# Altium schematic sheet UWB_Conectores.SchDoc
size A4
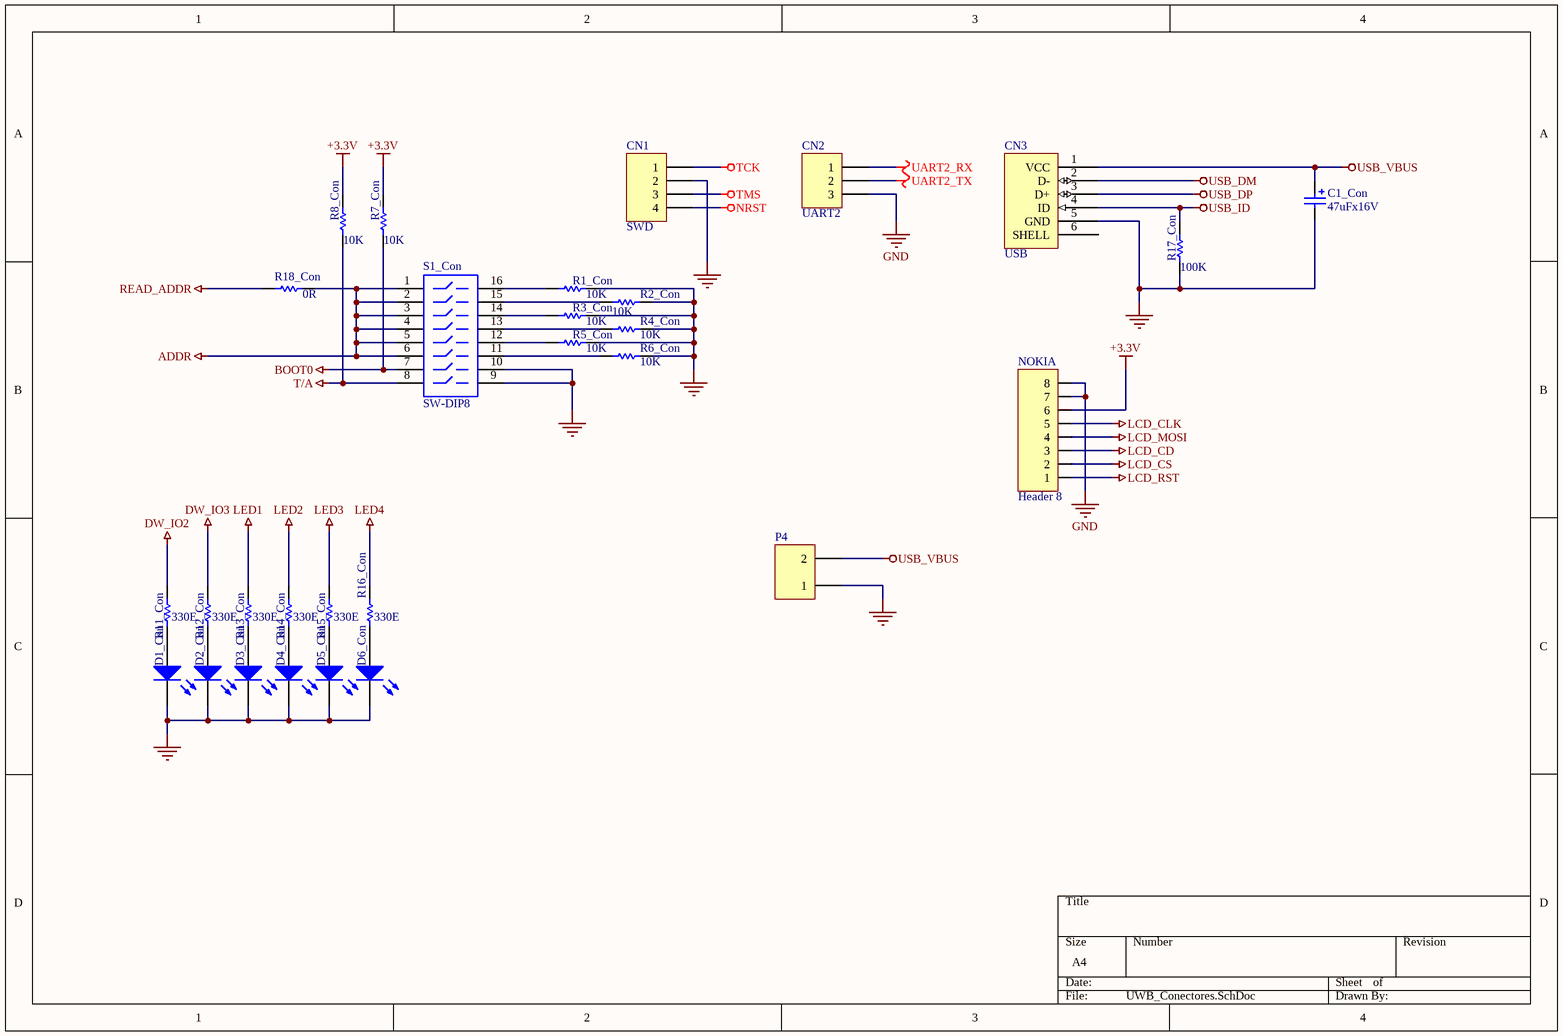
[diagram p0: UWB_Conectores.SchDoc]

## Parts
C1_Con  value 47uFx16V  [Panasonic Size D (Dia. 6.3)]  (hidden comment: Cap Pol1)
CN1  SWD  [HDR1X4 - SMALL]
CN2  UART2  [HDR1X3]
CN3  USB  [USB_Montaje]
D1_Con  LED  [LED SMD 0805]  (value not drawn)
D2_Con  LED  [LED SMD 0805]  (value not drawn)
D3_Con  LED  [LED SMD 0805]  (value not drawn)
D4_Con  LED  [LED SMD 0805]  (value not drawn)
D5_Con  LED  [LED SMD 0805]  (value not drawn)
D6_Con  LED  [LED SMD 0805]  (value not drawn)
NOKIA  Header 8  [HDR1X8]
P4  Header 2  [HDR1X2]  (value not drawn)
R1_Con  10K  [RESC1608M]
R2_Con  10K  [RESC1608M]
R3_Con  10K  [RESC1608M]
R4_Con  10K  [RESC1608M]
R5_Con  10K  [RESC1608M]
R6_Con  10K  [RESC1608M]
R7_Con  10K  [RESC1608M]
R8_Con  10K  [RESC1608N]
R11_Con  value 330E  [RESC1608N]  (hidden comment: Res1)
R12_Con  value 330E  [RESC1608N]  (hidden comment: Res1)
R13_Con  value 330E  [RESC1608N]  (hidden comment: Res1)
R14_Con  value 330E  [RESC1608N]  (hidden comment: Res1)
R15_Con  value 330E  [RESC1608N]  (hidden comment: Res1)
R16_Con  value 330E  [RESC1608N]  (hidden comment: Res1)
R17_Con  value 100K  [RESC1608M]  (hidden comment: 10K)
R18_Con  value 0R  [RESC1608M]  (hidden comment: 10K)
S1_Con  SW-DIP8  [DIP-16-KEY]

## Nets
+3.3V: NOKIA.6 R7_Con.1 R8_Con.1
ADDR: R18_Con.2 S1_Con.1 S1_Con.2 S1_Con.3 S1_Con.4 S1_Con.5 S1_Con.6
BOOT0: R7_Con.2 S1_Con.7
DW_IO2: R11_Con.2
DW_IO3: R12_Con.2
GND: C1_Con.2 CN1.2 CN2.3 CN3.5(GND) D1_Con.K D2_Con.K D3_Con.K D4_Con.K D5_Con.K D6_Con.K NOKIA.7 NOKIA.8 P4.1 R1_Con.2 R2_Con.1 R3_Con.1 R4_Con.1 R5_Con.1 R6_Con.1 R17_Con.2 S1_Con.9 S1_Con.10
LCD_CD: NOKIA.3
LCD_CLK: NOKIA.5
LCD_CS: NOKIA.2
LCD_MOSI: NOKIA.4
LCD_RST: NOKIA.1
LED1: R13_Con.2
LED2: R14_Con.2
LED3: R15_Con.2
LED4: R16_Con.2
NRST: CN1.4
READ_ADDR: R18_Con.1
T/A: R8_Con.2 S1_Con.8
TCK: CN1.1
TMS: CN1.3
UART2_RX: CN2.1
UART2_TX: CN2.2
USB_DM: CN3.2(D-)
USB_DP: CN3.3(D+)
USB_ID: CN3.4(ID) R17_Con.1
USB_VBUS: C1_Con.1 CN3.1(VCC) P4.2
NetD1_Con_A: D1_Con.A R11_Con.1
NetD2_Con_A: D2_Con.A R12_Con.1
NetD3_Con_A: D3_Con.A R13_Con.1
NetD4_Con_A: D4_Con.A R14_Con.1
NetD5_Con_A: D5_Con.A R15_Con.1
NetD6_Con_A: D6_Con.A R16_Con.1
NetR1_Con_1: R1_Con.1 S1_Con.16
NetR2_Con_2: R2_Con.2 S1_Con.15
NetR3_Con_2: R3_Con.2 S1_Con.14
NetR4_Con_2: R4_Con.2 S1_Con.13
NetR5_Con_2: R5_Con.2 S1_Con.12
NetR6_Con_2: R6_Con.2 S1_Con.11

Not connected (* = marked no-connect by the designer): CN3 6(SHELL)

## Library data of the parts
C1_Con = Cap Pol1: Polarized Capacitor (Radial); Published: 8-Jun-2000; LatestRevisionDate: 17-Jul-2002; LatestRevisionNote: Re-released for DXP Platform.; PackageReference: RB7.6-15; Publisher: Altium Limited
CN1 = Header 4: Header, 4-Pin; PN 2: CN1; LatestRevisionDate: 17-Jul-2002; LatestRevisionNote: Re-released for DXP Platform.; Publisher: Altium Limited
CN2 = Header 3: Header, 3-Pin; PN 2: CN3; LatestRevisionDate: 17-Jul-2002; LatestRevisionNote: Re-released for DXP Platform.; Publisher: Altium Limited
CN3 = USB-MINI-typeB connector: Manuf_Part_1: 5075BMR-05-SM; Proveedor: Future Electronics; Proveedor 2: Elemon; PN 2: CN2; Order: 5075BMR-05-SM; ECCN: ????; PN: *
D1_Con D2_Con D3_Con D4_Con D5_Con D6_Con = LED: Typical INFRARED GaAs LED; Published: 8-Jun-2000; LatestRevisionDate: 08-Jul-2005; LatestRevisionNote: Mech Layer 1 removed.; Publisher: Altium Limited
P4 = Header 2: Header, 2-Pin; LatestRevisionDate: 17-Jul-2002; LatestRevisionNote: Re-released for DXP Platform.; Publisher: Altium Limited
R1_Con R2_Con R3_Con R4_Con R5_Con R6_Con R7_Con R8_Con R17_Con = res1: Resistor; Proveedor: Future Electronics; PN: RC0603JR-0710KL; Proveedor 2: Elemon; PN 2: RS3866245; Published: 8-Jun-2000; Revision: July-2002: Re-released for DXP Platform.; Publisher: Altium Limited
  R1_Con R2_Con R3_Con R4_Con R5_Con R6_Con R7_Con R8_Con: Value: 10K
R11_Con R12_Con R13_Con R14_Con R15_Con R16_Con = Res1: Resistor; Published: 8-Jun-2000; LatestRevisionDate: 17-Jul-2002; LatestRevisionNote: Re-released for DXP Platform.; PackageReference: AXIAL-0.3; Publisher: Altium Limited
R18_Con = res1: Resistor; Proveedor: Future Electronics; Proveedor 2: Elemon; PN 2: RS3895900; Published: 8-Jun-2000; Revision: July-2002: Re-released for DXP Platform.; Publisher: Altium Limited
S1_Con = SW-DIP8: 4009 Series DIP Switch, Raised actuator; Published: 24-Mar-1999; LatestRevisionDate: 17-Dec-2003; LatestRevisionNote: PCB Footprint replaced.; PackageReference: DIP-16-KEY; Publisher: Altium Limited; PackageDescription: DIP; 16 Leads; Row Spacing 7.62 mm; Pitch 2.54 mm; ComponentLink1Description: Manufacturer Link; ComponentLink1URL: http://www.oupiin.com/prodindx.html#Headers